# Altium schematic sheet ADG904_sch.SchDoc
size A4; Organization1: VINCULADA AO EXÉRCITO BRASILEIRO; Organization2: FÁBRICA DE MATERIAL DE; Organization3: COMUNICAÇÕES E ELETRÔNICA; Organization0: INDÚSTRIA DE MATERIAL BÉLICO DO BRASIL; Esquematico: Esquemático
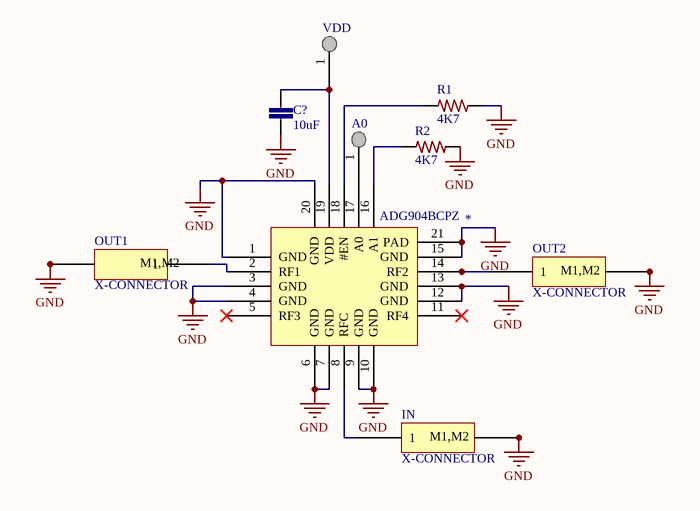
[diagram p0: ADG904_sch.SchDoc]

## Parts
*  ADG904BCPZ  [QFN50P400X400X80_HS-21N]
A0  (no value)  [New footprint 1]
C?  10uF  [CAPC0603(1608)55_L]
IN  X-CONNECTOR  [X-CONNECTOR-PCB]
OUT1  X-CONNECTOR  [X-CONNECTOR-PCB]
OUT2  X-CONNECTOR  [X-CONNECTOR-PCB]
R1  4K7  [0402-RES-HD]
R2  4K7  [0402-RES-HD]
VDD  (no value)  [New footprint 1]

## Nets
GND: *.1(GND) *.3(GND) *.4(GND) *.6(GND) *.7(GND) *.9(GND) *.10(GND) *.12(GND) *.13(GND) *.15(GND) *.20(GND) *.21(PAD) C?.2 IN.M1 IN.M2 OUT1.M1 OUT1.M2 OUT2.M1 OUT2.M2 R1.2 R2.2
Net*_2: *.2(RF1) OUT1.1
Net*_8: *.8(RFC) IN.1
Net*_14: *.14(RF2) OUT2.1
Net*_16: *.16(A1) R2.1
Net*_17: *.17(A0) A0.1
Net*_18: *.18(#EN) R1.1
Net*_19: *.19(VDD) C?.1 VDD.1

Not connected (* = marked no-connect by the designer): * 5(RF3)* 11(RF4)*

## Notes on the sheet
- USADO EQUIP.:
- DATA:
- ENG:
- VERIF:
- HORA:
- REV:
- APROV:
- TÍTULO:
- FOLHA:
- /
- FORMATO:
- A4
- CÓDIGO:
- ESTOQUE:
- (in symbol X-CONNECTOR-5) M1,M2

## Library data of the parts
* = ADG904BCPZ-01.A.1: RF Switch ICs WB 2.5GHz 37dB Iso CMOS 4:1 Mux/SP4T; Capacitance: 2E-12F
A0 VDD = TEST_VIA_RF-01.A.1: Test VIA for RF circuits
C? = C0603-10uF-16V-1: CAP CER 10UF 16V X5R 0603; Part No: EMK107BBJ106MA-T; Cod EMS: 05.281.019.592; Value: 10uF
IN OUT1 OUT2 = X-CONNECTOR-5: CONECTOR PARA MÓDULOS X MICROWAVE; RoHS: Yes; Mount: TH
R1 R2 = R0402-4K7-6: RES 4.7K OHM 1/10W 1% 0402 SMD; Part No: ERJ-2RKF4701X; Cod EMS: 05.280.029.526; Family Description: RESISTOR FILME ESPESSO 10R-1M / 1/10W / 1% / 0402. P/N: ERJ-2RKF....X – PANASONIC ELECTRONIC COMPONENTS.; Value: 4.7K; Family: ERJ-2RKF....X